# Altium schematic sheet Input.SchDoc: Input
size A4; Date: JUN 2020; ApprovedBy: Hören; CheckedBy: Mörz; Author: Rudziński; CompanyName: Semi-ATE; DrawnBy: Rudziński; Engineer: Hören; Organization: Semi-ATE; DocumentNumber: 9; Revision: V1.0; SheetNumber: 9; SheetTotal: 20
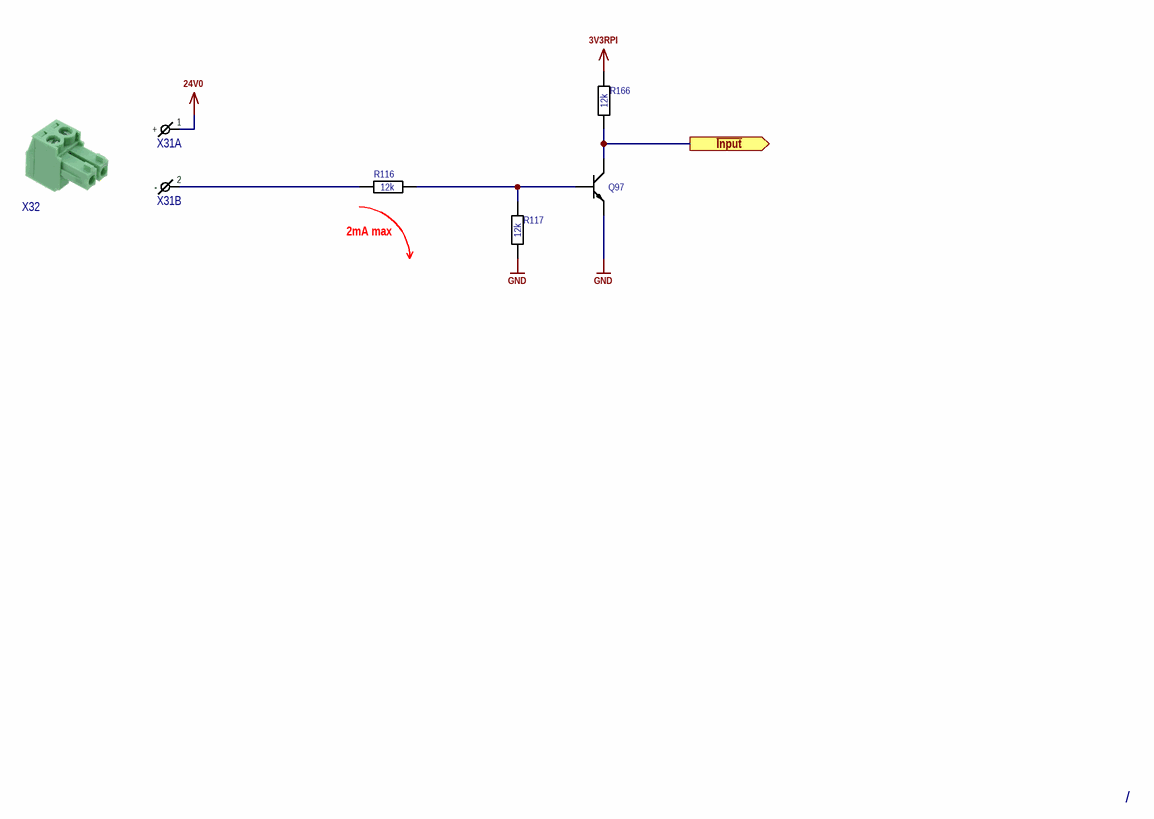
[diagram p0: Input.SchDoc]

## Parts
Q97  Q  [SOT23-3]  (value not drawn)
R116  value 12k  [R1206 Reflow]  (hidden comment: R)
R117  value 12k  [R1206 Reflow]  (hidden comment: R)
R166  value 12k  [R1206 Reflow]  (hidden comment: R)
X31  X  [691322310002]  (value not drawn)  (parts A,B of 2)
X32  X  [691361300002]  (value not drawn)

## Ports
~{Input} (out)

## Nets
3V3RPI: R166.2
24V0: X31.1(+)
GND: Q97.2(E) R117.1
~{Input}: Q97.3(C) R166.1 ; port ~{Input}
NetQ97_1: Q97.1(B) R116.2 R117.2
NetR116_1: R116.1 X31.2(-)

## Notes on the sheet
- (near R116) 2mA max
- /
- designed by
- reviewed by
- last drawn by
- Project:
- Schematic:
- last printed
- DIN-A4 L
- sheets
- of
- File:

## Library data of the parts
Q97 = NPN: MOSFET N-CH 25V 680MA SOT-23; 04. Manufacturer: ON Semiconductor; 07. Manufacturer  Part Number: FDV303N; 03. Unit Price: 0.41; 13. Created Date/Name: AUG 2018 / Hören; Rds On: 450 mΩ @ id=500mA & Vgs=4.5V; Vgs,th: 1.5V @ 250uA; Power Rating: 350mW; 3D-Export: No; 01. Distributor: DigiKey; 02. Distributor Part Number: FDV303NDKR-ND; 09. Operating Temperature: -55°C ~ 150°C (TJ); 11. RoHS: YES; ComponentLink1Description: Info; ComponentLink1URL: https://www.digikey.de/product-detail/en/on-semiconductor/FDV303N/FDV303NDKR-ND/1630434; ComponentLink2Description: DataSheet; ComponentLink2URL: https://media.digikey.com/pdf/Data%20Sheets/Fairchild%20PDFs/FDV303N.pdf; Vdss: 25V; Id: 680mA
R116 R117 R166 = R_23: RES SMD 12K OHM 1% 1/4W 1206; 04. Manufacturer: Yageo; 07. Manufacturer  Part Number: RC1206FR-0712KL; 03. Unit Price: 0.09; Tolerance: ±1%; ComponentLink1URL: *; ComponentLink1Description: Info; 02. Distributor Part Number: 311-12.0KFRTR-ND; 11. RoHS: YES; 01. Distributor: DigiKey; ComponentLink2Description: DataSheet; Package: 1206
X31 = 691322310002: TERM BLOCK HDR 2POS 90DEG 3.81MM; 04. Manufacturer: Würth Elektronik; 03. Unit Price: 0.32; 13. Created Date/Name: ??? / Hören; System: Connector; 01. Distributor: DigiKey; 02. Distributor Part Number: 732-2088-ND; 07. Manufacturer  Part Number: 691322310002; 11. RoHS: YES; ComponentLink1Description: Info; ComponentLink1URL: https://www.digikey.de/products/en?keywords=691322310002; ComponentLink2Description: DataSheet; ComponentLink2URL: https://media.digikey.com/pdf/Data%20Sheets/Wurth%20Electronics%20PDFs/Terminal%20Blocks%20WR-TBL.pdf
X32 = 691361300002: TERM BLOCK PLUG 2POS STR 3.81MM; 04. Manufacturer: Würth Elektronik; 03. Unit Price: 1.1; 13. Created Date/Name: ??? / Hören; System: Connector; 01. Distributor: DigiKey; 02. Distributor Part Number: 732-2076-ND; 07. Manufacturer  Part Number: 691361300002; ComponentLink1Description: Info; ComponentLink1URL: https://www.digikey.de/products/en?keywords=691361300002; ComponentLink2Description: DataSheet; ComponentLink2URL: https://media.digikey.com/pdf/Data%20Sheets/Wurth%20Electronics%20PDFs/Terminal%20Blocks%20WR-TBL.pdf